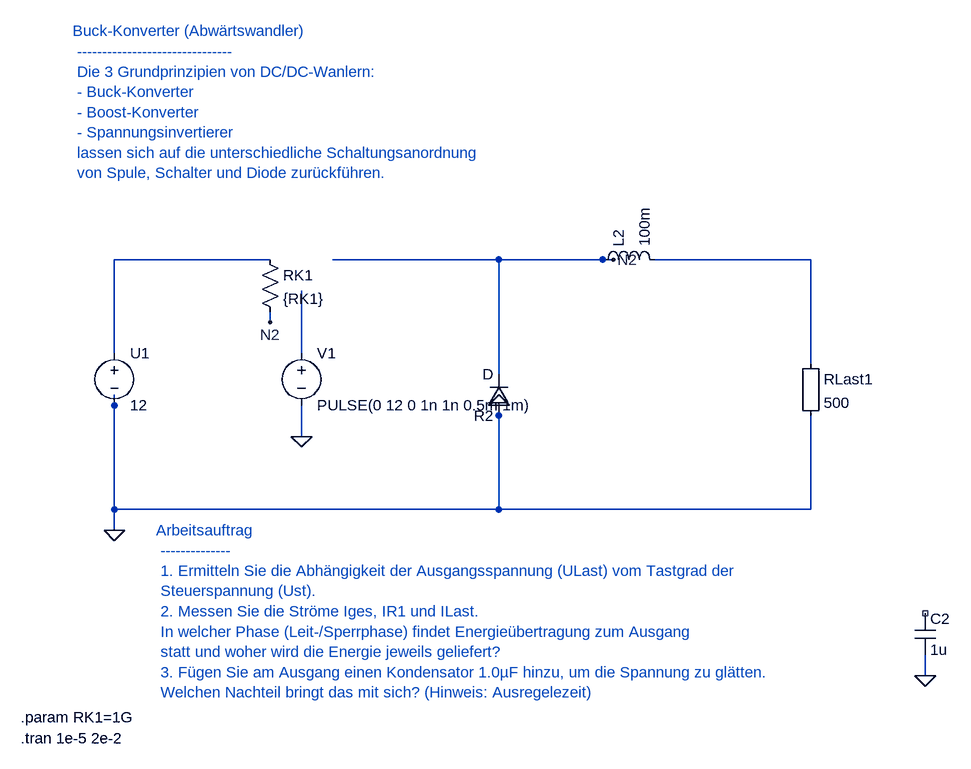
[diagram p0: schematic 2_1_1_Buck_Konverter.asc]
2_1_1_Buck_Konverter.asc, the LTspice schematic file:
Version 4
SHEET 1 880 680
WIRE 208 608 208 592
WIRE 800 560 800 528
WIRE 496 608 496 624
WIRE 1456 992 1456 1008
WIRE 448 384 208 384
WIRE 208 384 208 528
WIRE 544 384 800 384
WIRE 800 384 960 384
WIRE 800 528 800 384
WIRE 208 800 208 768
WIRE 800 624 800 768
WIRE 1280 544 1280 384
WIRE 1280 384 1040 384
WIRE 800 768 208 768
WIRE 1280 624 1280 768
WIRE 1280 768 800 768
WIRE 496 528 496 432
WIRE 496 656 496 624
WIRE 1456 1024 1456 1008
WIRE 208 768 208 592
WIRE 800 624 800 608
WIRE 448 464 448 480
WIRE 960 384 976 384
FLAG 208 800 0
FLAG 496 656 0
FLAG 1456 1024 0
FLAG 800 608 0
FLAG 496 656 0
FLAG 1456 1024 0
FLAG 448 480 N2
FLAG 976 384 N2
SYMBOL voltage 208 512 R0
SYMATTR InstName U1
SYMATTR Value 12
SYMBOL res 432 368 R0
SYMATTR InstName RK1
SYMATTR Value {RK1}
SYMBOL ind 944 400 R270
SYMATTR InstName L2
SYMATTR Value 100m
SYMBOL diode 816 624 R180
SYMATTR InstName R2
SYMATTR Value D
SYMBOL Misc\EuropeanResistor 1264 528 R0
SYMATTR InstName RLast1
SYMATTR Value 500
SYMBOL voltage 496 512 R0
SYMATTR InstName V1
SYMATTR Value PULSE(0 12 0 1n 1n 0.5m 1m)
SYMBOL cap 1440 928 R0
SYMATTR InstName C2
SYMATTR Value 1u
TEXT 64 1088 Left 2 !.param RK1=1G
TEXT 64 1120 Left 2 !.tran 1e-5 2e-2
TEXT 144 32 Left 2 ;Buck-Konverter (Abwärtswandler) \n ------------------------------- \n Die 3 Grundprinzipien von DC/DC-Wanlern: \n - Buck-Konverter \n - Boost-Konverter \n - Spannungsinvertierer \n lassen sich auf die unterschiedliche Schaltungsanordnung \n von Spule, Schalter und Diode zurückführen.
TEXT 272 800 Left 2 ;Arbeitsauftrag \n -------------- \n 1. Ermitteln Sie die Abhängigkeit der Ausgangsspannung (ULast) vom Tastgrad der \n Steuerspannung (Ust). \n 2. Messen Sie die Ströme Iges, IR1 und ILast. \n In welcher Phase (Leit-/Sperrphase) findet Energieübertragung zum Ausgang \n statt und woher wird die Energie jeweils geliefert? \n 3. Fügen Sie am Ausgang einen Kondensator 1.0µF hinzu, um die Spannung zu glätten. \n Welchen Nachteil bringt das mit sich? (Hinweis: Ausregelezeit)

The netlist it stands for:
* 2_1_1_Buck_Konverter.asc
V§U1 N001 0 12
RK1 N001 N2 {RK1}
L2 N2 N002 100m
D§R2 0 N2 D
RLast1 N002 0 500
V1 N003 0 PULSE(0 12 0 1n 1n 0.5m 1m)
C2 NC_01 0 1u
.model D D
.lib standard.dio
.param RK1=1G
.tran 1e-5 2e-2
* Buck-Konverter (Abwärtswandler)
*  -------------------------------
*  Die 3 Grundprinzipien von DC/DC-Wanlern:
*  - Buck-Konverter
*  - Boost-Konverter
*  - Spannungsinvertierer
*  lassen sich auf die unterschiedliche Schaltungsanordnung
*  von Spule, Schalter und Diode zurückführen.
* Arbeitsauftrag
*  --------------
*  1. Ermitteln Sie die Abhängigkeit der Ausgangsspannung (ULast) vom Tastgrad der
*  Steuerspannung (Ust).
*  2. Messen Sie die Ströme Iges, IR1 und ILast.
*  In welcher Phase (Leit-/Sperrphase) findet Energieübertragung zum Ausgang
*  statt und woher wird die Energie jeweils geliefert?
*  3. Fügen Sie am Ausgang einen Kondensator 1.0µF hinzu, um die Spannung zu glätten.
*  Welchen Nachteil bringt das mit sich? (Hinweis: Ausregelezeit)
.backanno
.end